# Altium schematic sheet TMS320F280049CPZS.SchDoc
size 342 x 177 mm
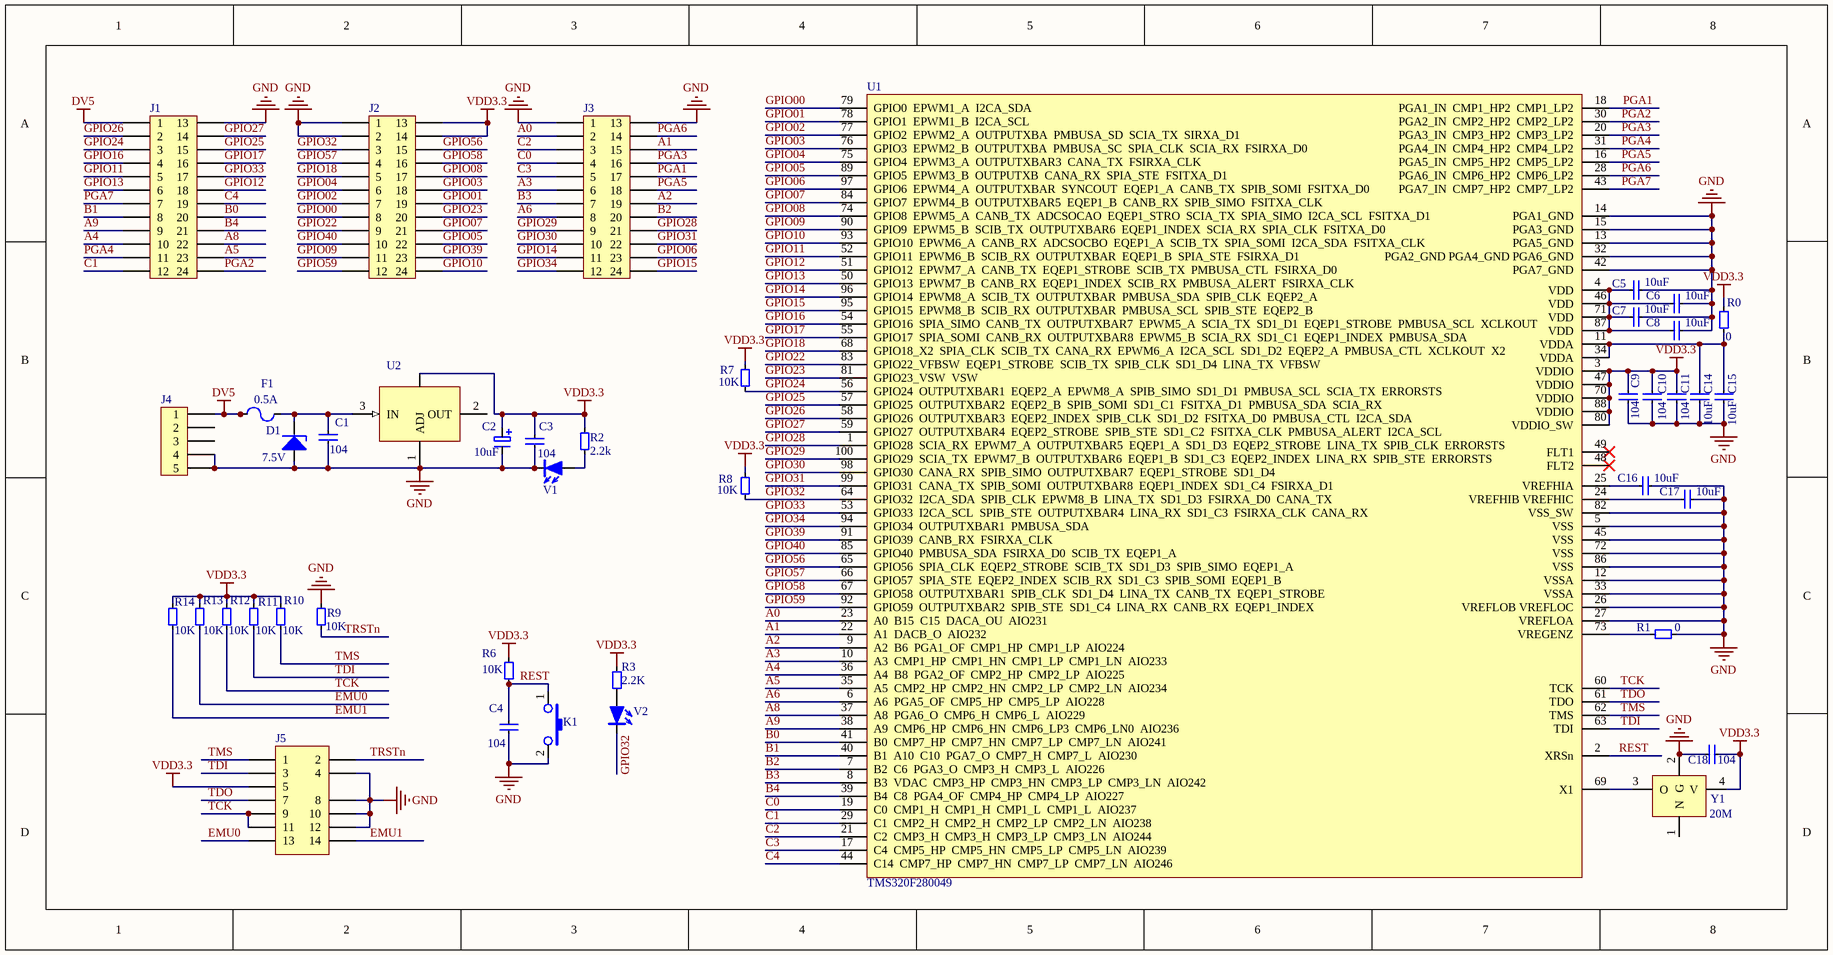
[diagram p0: TMS320F280049CPZS.SchDoc]

## Parts
C1  104  [0805_C_M]
C2  10uF  [CE3528]
C3  104  [0805_C_M]
C4  104  [0805_C_M]
C5  10uF  [0805_C_M]
C6  10uF  [0805_C_M]
C7  10uF  [0805_C_M]
C8  10uF  [0805_C_M]
C9  104  [0805_C_M]
C10  104  [0805_C_M]
C11  104  [0805_C_M]
C14  10uF  [0805_C_M]
C15  10uF  [0805_C_M]
C16  10uF  [0805_C_M]
C17  10uF  [0805_C_M]
C18  104  [0805_C_M]
D1  7.5V  [1206D]
F1  0.5A  [1812F]
J1  CON24  [CON24_2.54]  (value not drawn)
J2  CON24  [CON24_2.54]  (value not drawn)
J3  CON24  [CON24_2.54]  (value not drawn)
J4  SIP5  [MINIUSB-S]  (value not drawn)
J5  Header 7X2  [JTAG14]  (value not drawn)
K1  KEY1  (value not drawn)
R0  0  [0805_R_M]
R1  0  [0805_R_M]
R2  2.2k  [0805_R_M]
R3  2.2K  [0805_R_M]
R6  10K  [0805_R_M]
R7  10K  [0805_R_M]
R8  10K  [0805_R_M]
R9  10K  [0805_R_M]
R10  10K  [0805_R_M]
R11  10K  [0805_R_M]
R12  10K  [0805_R_M]
R13  10K  [0805_R_M]
R14  10K  [0805_R_M]
U1  TMS320F280049  [STM32F407VGT6]
U2  AMS1117-3.3  [LM1117]  (value not drawn)
V1  LED  [0805D]  (value not drawn)
V2  LED2  [0805D]  (value not drawn)
Y1  20M  [OSC5070]

## Nets
DV5: F1.1 J1.1 J4.1
GND: C1.2 C2.2 C3.2 C4.1 C5.2 C6.2 C7.2 C8.2 C9.2 C10.2 C11.2 C14.2 C15.2 C16.2 C17.2 C18.1 D1.1 J1.13 J2.1 J2.2 J3.1 J3.13 J4.4 J4.5 J5.4 J5.8 J5.10 J5.12 K1.2 R1.2 R9.2 U1.5(VSS) U1.12(VSSA) U1.13(PGA5_GND) U1.14(PGA1_GND) U1.15(PGA3_GND) U1.26(VREFLOB_VREFLOC) U1.27(VREFLOA) U1.32(PGA2_GND_PGA4_GND_PGA6_GND) U1.33(VSSA) U1.42(PGA7_GND) U1.45(VSS) U1.72(VSS) U1.82(VSS_SW) U1.86(VSS) U2.1(ADJ) V1.2 Y1.2(G)
VDD3.3: C2.1 C3.1 C9.1 C10.1 C11.1 C18.2 J2.13 J2.14 J5.5 R0.2 R2.1 R3.1 R6.1 R7.2 R8.1 R10.2 R11.2 R12.2 R13.2 R14.2 U1.3(VDDIO) U1.47(VDDIO) U1.70(VDDIO) U1.80(VDDIO_SW) U1.88(VDDIO) U2.4 Y1.4(V)
A0: J3.2 U1.23(A0__B15__C15__DACA_OU__AIO231)
A1: J3.15 U1.22(A1__DACB_O__AIO232)
A2: J3.19 U1.9(A2__B6__PGA1_OF__CMP1_HP__CMP1_LP__AIO224)
A3: J3.6 U1.10(A3__CMP1_HP__CMP1_HN__CMP1_LP__CMP1_LN__AIO233)
A4: J1.10 U1.36(A4__B8__PGA2_OF__CMP2_HP__CMP2_LP__AIO225)
A5: J1.23 U1.35(A5__CMP2_HP__CMP2_HN__CMP2_LP__CMP2_LN__AIO234)
A6: J3.8 U1.6(A6__PGA5_OF__CMP5_HP__CMP5_LP__AIO228)
A8: J1.22 U1.37(A8__PGA6_O__CMP6_H__CMP6_L__AIO229)
A9: J1.9 U1.38(A9__CMP6_HP__CMP6_HN__CMP6_LP3__CMP6_LN0__AIO236)
B0: J1.20 U1.41(B0__CMP7_HP__CMP7_HN__CMP7_LP__CMP7_LN__AIO241)
B1: J1.8 U1.40(B1__A10__C10__PGA7_O__CMP7_H__CMP7_L__AIO230)
B2: J3.20 U1.7(B2__C6__PGA3_O__CMP3_H__CMP3_L__AIO226)
B3: J3.7 U1.8(B3__VDAC__CMP3_HP__CMP3_HN__CMP3_LP__CMP3_LN__AIO242)
B4: J1.21 U1.39(B4__C8__PGA4_OF__CMP4_HP__CMP4_LP__AIO227)
C0: J3.4 U1.19(C0__CMP1_H__CMP1_H__CMP1_L__CMP1_L__AIO237)
C1: J1.12 U1.29(C1__CMP2_H__CMP2_H__CMP2_LP__CMP2_LN__AIO238)
C2: J3.3 U1.21(C2__CMP3_H__CMP3_H__CMP3_LP__CMP3_LN__AIO244)
C3: J3.5 U1.17(C4__CMP5_HP__CMP5_HN__CMP5_LP__CMP5_LN__AIO239)
C4: J1.19 U1.44(C14__CMP7_HP__CMP7_HN__CMP7_LP__CMP7_LN__AIO246)
EMU0: J5.13 R13.1
EMU1: J5.14 R14.1
GPIO00: J2.8 U1.79(GPIO0__EPWM1_A__I2CA_SDA)
GPIO01: J2.19 U1.78(GPIO1__EPWM1_B__I2CA_SCL)
GPIO02: J2.7 U1.77(GPIO2__EPWM2_A__OUTPUTXBA__PMBUSA_SD__SCIA_TX__SIRXA_D1)
GPIO03: J2.18 U1.76(GPIO3__EPWM2_B__OUTPUTXBA__PMBUSA_SC__SPIA_CLK__SCIA_RX__FSIRXA_D0)
GPIO04: J2.6 U1.75(GPIO4__EPWM3_A__OUTPUTXBAR3__CANA_TX__FSIRXA_CLK)
GPIO05: J2.22 U1.89(GPIO5__EPWM3_B__OUTPUTXB__CANA_RX__SPIA_STE__FSITXA_D1)
GPIO06: J3.23 U1.97(GPIO6__EPWM4_A__OUTPUTXBAR__SYNCOUT__EQEP1_A__CANB_TX__SPIB_SOMI__FSITXA_D0)
GPIO07: J2.21 U1.84(GPIO7__EPWM4_B__OUTPUTXBAR5__EQEP1_B__CANB_RX__SPIB_SIMO__FSITXA_CLK)
GPIO08: J2.17 U1.74(GPIO8__EPWM5_A__CANB_TX__ADCSOCAO__EQEP1_STRO__SCIA_TX__SPIA_SIMO__I2CA_SCL__FSITXA_D1)
GPIO09: J2.11 U1.90(GPIO9__EPWM5_B__SCIB_TX__OUTPUTXBAR6__EQEP1_INDEX__SCIA_RX__SPIA_CLK__FSITXA_D0)
GPIO10: J2.24 U1.93(GPIO10__EPWM6_A__CANB_RX__ADCSOCBO__EQEP1_A__SCIB_TX__SPIA_SOMI__I2CA_SDA__FSITXA_CLK)
GPIO11: J1.5 U1.52(GPIO11__EPWM6_B__SCIB_RX__OUTPUTXBAR__EQEP1_B__SPIA_STE__FSIRXA_D1)
GPIO12: J1.18 U1.51(GPIO12__EPWM7_A__CANB_TX__EQEP1_STROBE__SCIB_TX__PMBUSA_CTL__FSIRXA_D0)
GPIO13: J1.6 U1.50(GPIO13__EPWM7_B__CANB_RX__EQEP1_INDEX__SCIB_RX__PMBUSA_ALERT__FSIRXA_CLK)
GPIO14: J3.11 U1.96(GPIO14__EPWM8_A__SCIB_TX__OUTPUTXBAR__PMBUSA_SDA__SPIB_CLK__EQEP2_A)
GPIO15: J3.24 U1.95(GPIO15__EPWM8_B__SCIB_RX__OUTPUTXBAR__PMBUSA_SCL__SPIB_STE__EQEP2_B)
GPIO16: J1.4 U1.54(GPIO16__SPIA_SIMO__CANB_TX__OUTPUTXBAR7__EPWM5_A__SCIA_TX__SD1_D1__EQEP1_STROBE__PMBUSA_SCL__XCLKOUT)
GPIO17: J1.16 U1.55(GPIO17__SPIA_SOMI__CANB_RX__OUTPUTXBAR8__EPWM5_B__SCIA_RX__SD1_C1__EQEP1_INDEX__PMBUSA_SDA)
GPIO18: J2.5 U1.68(GPIO18_X2__SPIA_CLK__SCIB_TX__CANA_RX__EPWM6_A__I2CA_SCL__SD1_D2__EQEP2_A__PMBUSA_CTL__XCLKOUT__X2)
GPIO22: J2.9 U1.83(GPIO22_VFBSW__EQEP1_STROBE__SCIB_TX__SPIB_CLK__SD1_D4__LINA_TX__VFBSW)
GPIO23: J2.20 U1.81(GPIO23_VSW__VSW)
GPIO24: J1.3 R7.1 U1.56(GPIO24__OUTPUTXBAR1__EQEP2_A__EPWM8_A__SPIB_SIMO__SD1_D1__PMBUSA_SCL__SCIA_TX__ERRORSTS)
GPIO25: J1.15 U1.57(GPIO25__OUTPUTXBAR2__EQEP2_B__SPIB_SOMI__SD1_C1__FSITXA_D1__PMBUSA_SDA__SCIA_RX)
GPIO26: J1.2 U1.58(GPIO26__OUTPUTXBAR3__EQEP2_INDEX__SPIB_CLK__SD1_D2__FSITXA_D0__PMBUSA_CTL__I2CA_SDA)
GPIO27: J1.14 U1.59(GPIO27__OUTPUTXBAR4__EQEP2_STROBE__SPIB_STE__SD1_C2__FSITXA_CLK__PMBUSA_ALERT__I2CA_SCL)
GPIO28: J3.21 U1.1(GPIO28__SCIA_RX__EPWM7_A__OUTPUTXBAR5__EQEP1_A__SD1_D3__EQEP2_STROBE__LINA_TX__SPIB_CLK__ERRORSTS)
GPIO29: J3.9 U1.100(GPIO29__SCIA_TX__EPWM7_B__OUTPUTXBAR6__EQEP1_B__SD1_C3__EQEP2_INDEX__LINA_RX__SPIB_STE__ERRORSTS)
GPIO30: J3.10 U1.98(GPIO30__CANA_RX__SPIB_SIMO__OUTPUTXBAR7__EQEP1_STROBE__SD1_D4)
GPIO31: J3.22 U1.99(GPIO31__CANA_TX__SPIB_SOMI__OUTPUTXBAR8__EQEP1_INDEX__SD1_C4__FSIRXA_D1)
GPIO32: J2.3 R8.2 U1.64(GPIO32__I2CA_SDA__SPIB_CLK__EPWM8_B__LINA_TX__SD1_D3__FSIRXA_D0__CANA_TX) V2.2
GPIO33: J1.17 U1.53(GPIO33__I2CA_SCL__SPIB_STE__OUTPUTXBAR4__LINA_RX__SD1_C3__FSIRXA_CLK__CANA_RX)
GPIO34: J3.12 U1.94(GPIO34__OUTPUTXBAR1__PMBUSA_SDA)
GPIO39: J2.23 U1.91(GPIO39__CANB_RX__FSIRXA_CLK)
GPIO40: J2.10 U1.85(GPIO40__PMBUSA_SDA__FSIRXA_D0__SCIB_TX__EQEP1_A)
GPIO56: J2.15 U1.65(GPIO56__SPIA_CLK__EQEP2_STROBE__SCIB_TX__SD1_D3__SPIB_SIMO__EQEP1_A)
GPIO57: J2.4 U1.66(GPIO57__SPIA_STE__EQEP2_INDEX__SCIB_RX__SD1_C3__SPIB_SOMI__EQEP1_B)
GPIO58: J2.16 U1.67(GPIO58__OUTPUTXBAR1__SPIB_CLK__SD1_D4__LINA_TX__CANB_TX__EQEP1_STROBE)
GPIO59: J2.12 U1.92(GPIO59__OUTPUTXBAR2__SPIB_STE__SD1_C4__LINA_RX__CANB_RX__EQEP1_INDEX)
PGA1: J3.17 U1.18(PGA1_IN__CMP1_HP2__CMP1_LP2)
PGA2: J1.24 U1.30(PGA2_IN__CMP2_HP2__CMP2_LP2)
PGA3: J3.16 U1.20(PGA3_IN__CMP3_HP2__CMP3_LP2)
PGA4: J1.11 U1.31(PGA4_IN__CMP4_HP2__CMP4_LP2)
PGA5: J3.18 U1.16(PGA5_IN__CMP5_HP2__CMP5_LP2)
PGA6: J3.14 U1.28(PGA6_IN__CMP6_HP2__CMP6_LP2)
PGA7: J1.7 U1.43(PGA7_IN__CMP7_HP2__CMP7_LP2)
REST: C4.2 K1.1 R6.2 U1.2(XRSn)
TCK: J5.9 J5.11 R12.1 U1.60(TCK)
TDI: J5.3 R11.1 U1.63(TDI)
TDO: J5.7 U1.61(TDO)
TMS: J5.1 R10.1 U1.62(TMS)
TRSTn: J5.2 R9.1
NetC1_1: C1.1 D1.2 F1.2 U2.3(IN)
NetC5_1: C5.1 C6.1 C7.1 C8.1 U1.4(VDD) U1.46(VDD) U1.71(VDD) U1.87(VDD)
NetC14_1: C14.1 C15.1 R0.1 U1.11(VDDA) U1.34(VDDA)
NetC16_1: C16.1 U1.25(VREFHIA)
NetC17_1: C17.1 U1.24(VREFHIB_VREFHIC)
NetR1_1: R1.1 U1.73(VREGENZ)
NetR2_2: R2.2 V1.1
NetR3_2: R3.2 V2.1
NetU1_69: U1.69(X1) Y1.3(O)

Not connected (* = marked no-connect by the designer): J4 2 3; U1 48(FLT2)* 49(FLT1)*; U2 2(OUT); Y1 1(N)

## Library data of the parts
C1 C3-C11 C14-C18 = C3
C2 = E3
D1 = D4
F1 = FUSE1
J5 = Header 7X2: Header, 7-Pin, Dual row; Revision: 17-Jul-2002: Re-released for DXP Platform.; Publisher: Altium Limited
R0-R3 R6-R14 = R3
U2 = 1117
V1 = LED2
Y1 = CY2_有源